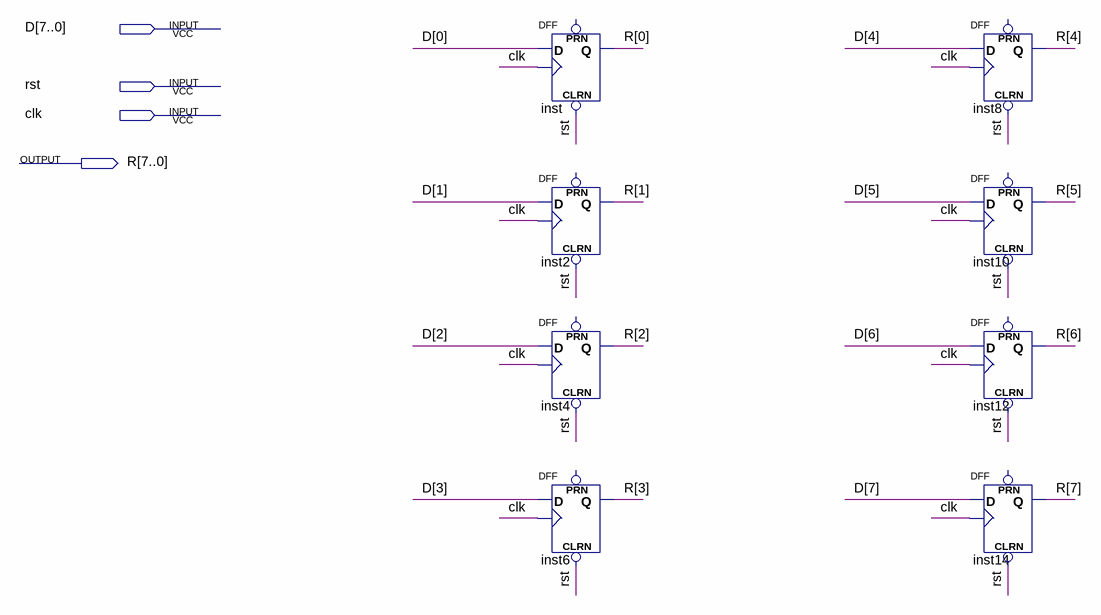
[diagram p0: schematic sheet]
// Quartus schematic Reg8b.bdf as structural Verilog: 8 symbols, 4 pins
module Reg8b (
  input  [7:0] D,
  input  rst,
  input  clk,
  output [7:0] R
);

  DFF inst (.CLRN(rst), .CLK(clk), .D(D[0]), .Q(R[0]));  // open: PRN
  DFF inst2 (.CLRN(rst), .CLK(clk), .D(D[1]), .Q(R[1]));  // open: PRN
  DFF inst4 (.CLRN(rst), .CLK(clk), .D(D[2]), .Q(R[2]));  // open: PRN
  DFF inst6 (.CLRN(rst), .CLK(clk), .D(D[3]), .Q(R[3]));  // open: PRN
  DFF inst8 (.CLRN(rst), .CLK(clk), .D(D[4]), .Q(R[4]));  // open: PRN
  DFF inst10 (.CLRN(rst), .CLK(clk), .D(D[5]), .Q(R[5]));  // open: PRN
  DFF inst12 (.CLRN(rst), .CLK(clk), .D(D[6]), .Q(R[6]));  // open: PRN
  DFF inst14 (.CLRN(rst), .CLK(clk), .D(D[7]), .Q(R[7]));  // open: PRN
endmodule
